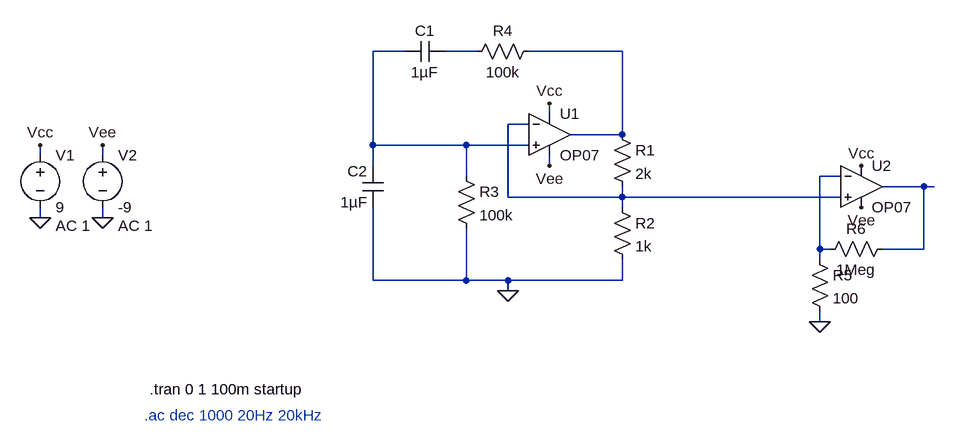
[diagram p0: schematic Wein Bridge demo.asc]
Wein Bridge demo.asc, the LTspice schematic file:
Version 4
SHEET 1 1188 680
WIRE 368 -64 320 -64
WIRE 480 -64 432 -64
WIRE 704 -64 560 -64
WIRE 592 32 592 16
WIRE 560 48 528 48
WIRE 704 64 704 -64
WIRE 704 64 624 64
WIRE 320 80 320 -64
WIRE 464 80 320 80
WIRE 560 80 464 80
WIRE -192 96 -192 80
WIRE -96 96 -96 80
WIRE 320 112 320 80
WIRE 592 112 592 96
WIRE 464 128 464 80
WIRE 1040 128 1008 128
WIRE 1168 144 1104 144
WIRE 1184 144 1168 144
WIRE 528 160 528 48
WIRE 704 160 704 144
WIRE 704 160 528 160
WIRE 1040 160 704 160
WIRE 704 176 704 160
WIRE -192 192 -192 176
WIRE -96 192 -96 176
WIRE 1008 240 1008 128
WIRE 1024 240 1008 240
WIRE 1168 240 1168 144
WIRE 1168 240 1104 240
WIRE 1008 256 1008 240
WIRE 320 288 320 176
WIRE 464 288 464 208
WIRE 464 288 320 288
WIRE 528 288 464 288
WIRE 704 288 704 256
WIRE 704 288 528 288
WIRE 528 304 528 288
WIRE 1008 352 1008 336
FLAG -96 192 0
FLAG -192 192 0
FLAG -192 80 Vcc
FLAG -96 80 Vee
FLAG 592 16 Vcc
FLAG 528 304 0
FLAG 592 112 Vee
FLAG 1008 352 0
FLAG 1072 176 Vee
FLAG 1072 112 Vcc
SYMBOL OpAmps\\OP07 592 0 R0
SYMATTR InstName U1
SYMBOL voltage -192 80 R0
WINDOW 123 24 124 Left 2
WINDOW 39 0 0 Left 0
SYMATTR Value2 AC 1
SYMATTR InstName V1
SYMATTR Value 9
SYMBOL voltage -96 80 R0
WINDOW 123 24 124 Left 2
WINDOW 39 0 0 Left 0
SYMATTR Value2 AC 1
SYMATTR InstName V2
SYMATTR Value -9
SYMBOL res 688 48 R0
SYMATTR InstName R1
SYMATTR Value 2k
SYMBOL res 688 160 R0
SYMATTR InstName R2
SYMATTR Value 1k
SYMBOL res 448 112 R0
SYMATTR InstName R3
SYMATTR Value 100k
SYMBOL cap 336 176 R180
WINDOW 0 24 56 Left 2
WINDOW 3 24 8 Left 2
SYMATTR InstName C2
SYMATTR Value 1µF
SYMBOL res 576 -80 R90
WINDOW 0 0 56 VBottom 2
WINDOW 3 32 56 VTop 2
SYMATTR InstName R4
SYMATTR Value 100k
SYMBOL cap 432 -80 R90
WINDOW 0 0 32 VBottom 2
WINDOW 3 32 32 VTop 2
SYMATTR InstName C1
SYMATTR Value 1µF
SYMBOL OpAmps\\OP07 1072 80 R0
SYMATTR InstName U2
SYMBOL res 992 240 R0
SYMATTR InstName R5
SYMATTR Value 100
SYMBOL res 1120 224 R90
WINDOW 0 0 56 VBottom 2
WINDOW 3 32 56 VTop 2
SYMATTR InstName R6
SYMATTR Value 1Meg
TEXT -24 456 Left 2 !.tran 0 1 100m startup
TEXT -32 496 Left 2 ;.ac dec 1000 20Hz 20kHz

The netlist it stands for:
* Wein Bridge demo.asc
XU1 N001 N004 Vcc Vee N003 LT1001  ; OP07, pins In+ In- V+ V- OUT
V1 Vcc 0 9 AC 1
V2 Vee 0 -9 AC 1
R1 N003 N004 2k
R2 N004 0 1k
R3 N001 0 100k
C2 0 N001 1µF
R4 N003 N002 100k
C1 N002 N001 1µF
XU2 N004 N005 Vcc Vee N006 LT1001  ; OP07, pins In+ In- V+ V- OUT
R5 N005 0 100
R6 N006 N005 1Meg
.tran 0 1 100m startup
* .ac dec 1000 20Hz 20kHz
.lib LTC.lib
.backanno
.end